# EAGLE design battery-charger (EAGLE 7.3.0)
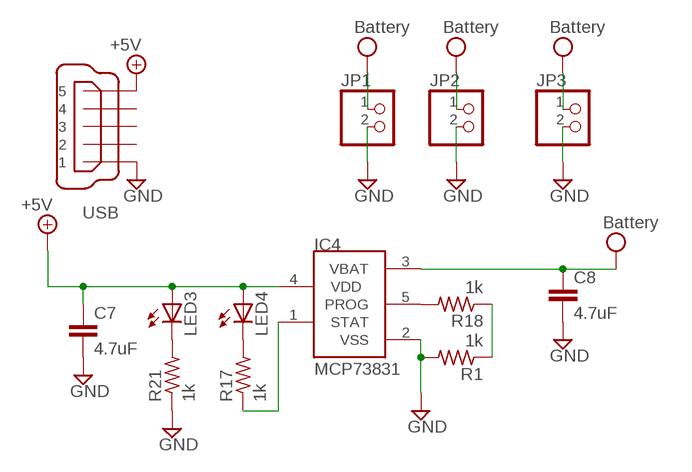
[diagram p0: schematic, sheet 1]

## Parts
C7  4.7uF  C-EU025-024X044  [C025-024X044]
C8  4.7uF  C-EU025-024X044  [C025-024X044]
IC4  MCP73831  [SOT23-5L]
JP1  PINHD-1X2  [1X02]
JP2  PINHD-1X2  [1X02]
JP3  PINHD-1X2  [1X02]
LED3  LED3MM  [LED3MM]
LED4  LED3MM  [LED3MM]
R1  1k  R-US_MELF0204R  [MINI_MELF-0204R]
R17  1k  R-US_MELF0204R  [MINI_MELF-0204R]
R18  1k  R-US_MELF0204R  [MINI_MELF-0204R]
R21  1k  R-US_MELF0204R  [MINI_MELF-0204R]
USB  MICRO-USB-ZX62R-B-5P  [ZX62R-B-5P]

## Nets
+5V/2: C7.1 IC4.4(VDD) LED3.A LED4.A USB.5 ; supply symbol labelled +5V
GND: C7.2 C8.2 IC4.2(VSS) JP1.2 JP2.2 JP3.2 R1.2 R21.1 USB.1
N$1: LED3.K(C) R21.2
N$2: LED4.K(C) R17.2
N$3: R1.1 R18.1
N$20: IC4.1(STAT) R17.1
N$23: IC4.5(PROG) R18.2
VCC: C8.1 IC4.3(VBAT) JP1.1 JP2.1 JP3.1 ; supply symbol labelled Battery
Unconnected: USB.2 USB.3 USB.4

## Library data of the parts
C7 C8 = rcl:C-EU: CAPACITOR, European symbol
IC4 = microchip-update-2:MCP73831: Miniature Single-Cell, Fully Integrated Li-Ion, Li-Polymer Charge Management Controllers
JP1-JP3 = pinhead:PINHD-1X2: PIN HEADER
LED3 LED4 = led:LED: LED OSRAM: - CHIPLED LG R971, LG N971, LY N971, LG Q971, LY Q971, LO R971, LY R971 LH N974, LH R974 LS Q976, LO Q976, LY Q976 LO Q996 - Hyper CHIPLED LW Q18S LB Q993, LB Q99A, LB R99A - SideLED LS A670, LO A670, LY A670, LG A670, LP A670 LB A673, LV A673, LT A673, LW A673 LH A674 LY A675 LS A676, LA A676, LO A676, LY A676, LW A676 LS A679, LY A679, LG A679 - Hyper Micro SIDELED® LS Y876, LA Y876, LO Y876, LY Y876 LT Y87S - SmartLED LW L88C, LW L88S LB L89C, LB L89S, LG L890 LS L89K, LO L89K, LY L89K LS L896, LA L896, LO L896, LY L896 - TOPLED LS T670, LO T670, LY T670, LG T670, LP T670 LSG T670, LSP T670, LSY T670, LOP T670, LYG T670 LG T671, LOG T671, LSG T671 LB T673, LV T673, LT T673, LW T673 LH T674 LS T676, LA T676, LO T676, LY T676, LB T676, LH T676, LSB T676, LW T676 LB T67C, LV T67C, LT T67C, LS T67K, LO T67K, LY T67K, LW E67C LS E67B, LA E67B, LO E67B, LY E67B, LB E67C, LV E67C, LT E67C LW T67C LS T679, LY T679, LG T679 LS T770, LO T770, LY T770, LG T770, LP T770 LB T773, LV T773, LT T773, LW T773 LH T774 LS E675, LA E675, LY E675, LS T675 LS T776, LA T776, LO T776, LY T776, LB T776 LHGB T686 LT T68C, LB T68C - Hyper Mini TOPLED® LB M676 - Mini TOPLED Santana® LG M470 LS M47K, LO M47K, LY M47K Source: http://www.osram.convergy.de LUXEON: - LUMILED® LXK2-PW12-R00, LXK2-PW12-S00, LXK2-PW14-U00, LXK2-PW14-V00 LXK2-PM12-R00, LXK2-PM12-S00, LXK2-PM14-U00 LXK2-PE12-Q00, LXK2-PE12-R00, LXK2-PE12-S00, LXK2-PE14-T00, LXK2-PE14-U00 LXK2-PB12-K00, LXK2-PB12-L00, LXK2-PB12-M00, LXK2-PB14-N00, LXK2-PB14-P00, LXK2-PB14-Q00 LXK2-PR12-L00, LXK2-PR12-M00, LXK2-PR14-Q00, LXK2-PR14-R00 LXK2-PD12-Q00, LXK2-PD12-R00, LXK2-PD12-S00 LXK2-PH12-R00, LXK2-PH12-S00 LXK2-PL12-P00, LXK2-PL12-Q00, LXK2-PL12-R00 Source: www.luxeon.com KINGBRIGHT: KA-3528ASYC Source: www.kingbright.com
R1 R17 R18 R21 = rcl:R-US_: RESISTOR, American symbol
USB = con-hirose:MICRO-USB-: Hirose Micro USB Connector ZX62R-B-5P: Micro B, reverse (top mount) shell SMT Supplier: DigiKey H11574CT-ND Source: http://www.hirose.co.jp/cataloge_hp/e24200011.pdf

## Board
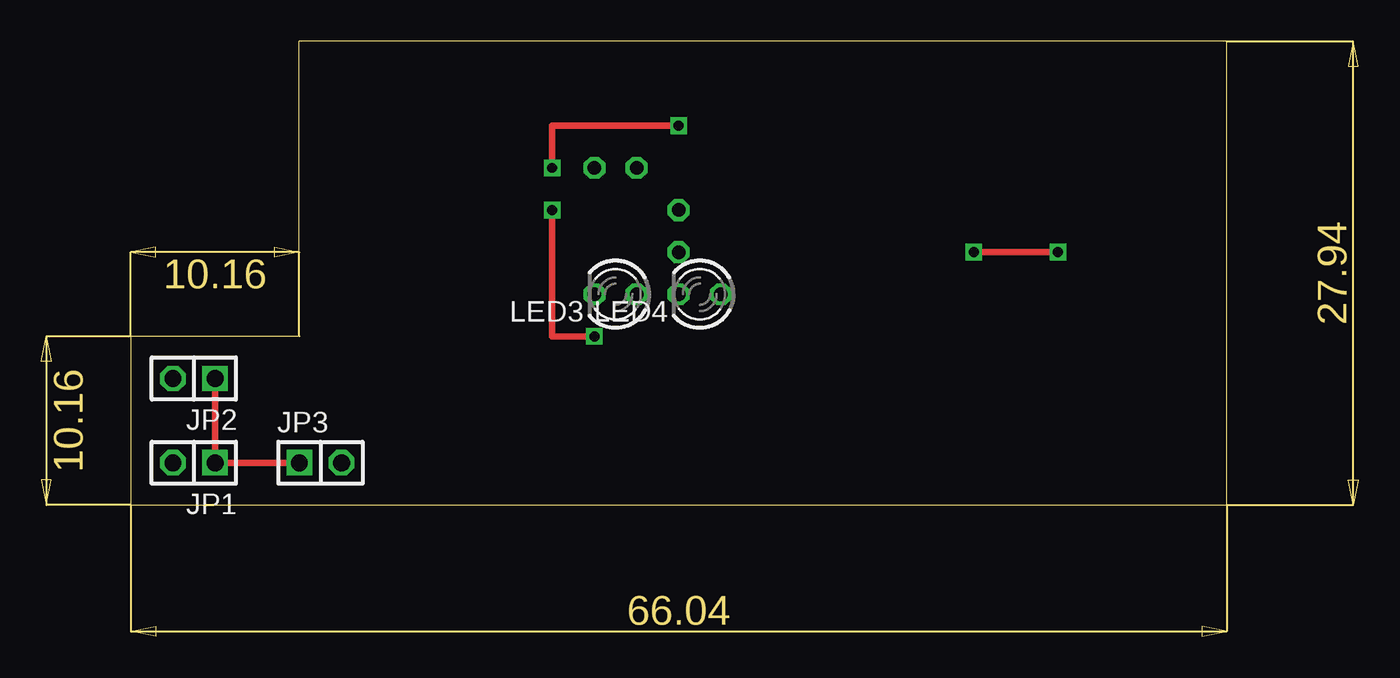
[diagram p1: board, top side]
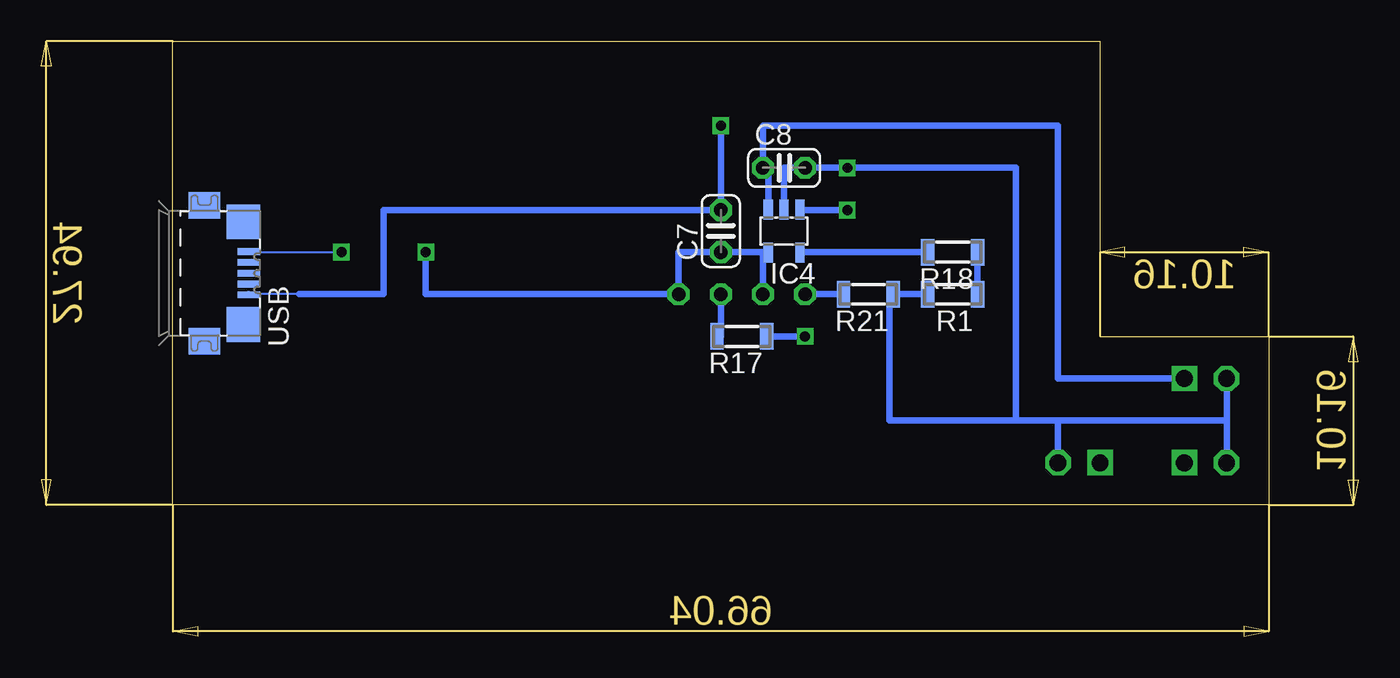
[diagram p2: board, bottom side, seen from below]

Size 66.04 x 27.94 mm. Coordinates in mm from the lower left corner, seen from the top.
Outline: 0,0 66.04,0 66.04,27.94 10.16,27.94 10.16,10.16 0,10.16 0,0
Copper layers (1*16): Top 0.035mm / dielectric 1.5mm / Bottom 0.035mm
Design rules "default": minimum track width 10mil, minimum drill 24mil, track to track 8mil, track to pad 8mil, pad to pad 8mil, via to via 8mil, smd to smd 8mil, copper to edge 40mil, drill to drill 8mil, minimum pad ring 10mil, minimum via ring 8mil, stop-mask expansion 4mil, vias tented up to drill 0mil, thermal gap 10mil

### Footprints (pad centres in the part's own frame; a part is rotated, then mirrored left to right if it is on the bottom)
C025-024X044 = drill 0.813 octagon: 1 -1.27,0; 2 1.27,0
SOT23-5L = smd 0.55 x 1.2: 1 -0.95,-1.3; 2 0,-1.3; 3 0.95,-1.3; 4 0.95,1.3; 5 -0.95,1.3
1X02 = drill 1.016 square: 1 -1.27,0 | drill 1.016 octagon: 2 1.27,0
LED3MM = drill 0.813 octagon: A -1.27,0; K 1.27,0
MINI_MELF-0204R = smd 0.8 x 1.6: 1 -1.5,0; 2 1.5,0
ZX62R-B-5P = smd 1.35 x 0.4: 1 2.675,-1.3; 2 2.675,-0.65; 3 2.675,0; 4 2.675,0.65; 5 2.675,1.3 | smd 1.9 x 1.6: M1 0,-4.1; M2 0,4.1 | smd 2 x 2.1: M3 2.35,3.1; M4 2.35,-3.1

### Placement (x,y rotation side)
C7  33.02,16.51 90 bottom
C8  29.21,20.32 0 bottom
IC4  29.21,16.51 180 bottom
JP1  3.81,2.54 180 top
JP2  3.81,7.62 180 top
JP3  11.43,2.54 0 top
LED3  29.21,12.7 180 top
LED4  34.29,12.7 180 top
R1  19.05,12.7 180 bottom
R17  31.75,10.16 180 bottom
R18  19.05,15.24 180 bottom
R21  24.13,12.7 180 bottom
USB  64.14,13.97 0 bottom

### Tracks (layer width: path | path; a pad name or v marks a point on that pad's centre or on a via)
+5V/2  (via drill 0.6)
  Top 0.406: v50.8,15.24 v55.88,15.24
  Bottom 0.127: 60.96,15.24 v55.88,15.24
  Bottom 0.406: IC4.4 30.48,15.24 | 30.48,15.24 LED3.A | 30.48,15.24 C7.1 35.56,15.24 LED4.A 50.8,12.7 v50.8,15.24 | USB.5 60.96,15.27 60.96,15.24
GND  (via drill 0.6)
  Top 0.406: v25.4,20.32 25.4,22.86 v33.02,22.86
  Bottom 0.127: 58.42,12.7 61.46,12.7
  Bottom 0.406: JP2.2 2.54,5.08 | 2.54,5.08 JP1.2 | 2.54,5.08 12.7,5.08 | 12.7,5.08 15.24,5.08 | 15.24,5.08 22.86,5.08 22.86,12.7 R21.1 20.32,12.7 20.55,12.93 R1.2 | JP3.2 12.7,5.08 | IC4.2 29.21,20.32 C8.2 v25.4,20.32 15.24,20.32 15.24,5.08 | v33.02,22.86 C7.2 53.34,17.78 53.34,12.7 58.42,12.7 | 61.46,12.7 USB.1
N$1
  Bottom 0.406: R21.2 LED3.K
N$2
  Bottom 0.406: R17.2 33.02,10.16 LED4.K
N$3
  Bottom 0.406: R18.1 R1.1
N$20  (via drill 0.6)
  Top 0.406: v27.94,10.16 25.4,10.16 v25.4,17.78
  Bottom 0.406: R17.1 v27.94,10.16 | IC4.1 27.94,17.78 v25.4,17.78
N$23
  Bottom 0.406: 20.32,15.24 R18.2 27.94,15.24 IC4.5
VCC
  Top 0.406: JP2.1 JP1.1 JP3.1
  Bottom 0.406: IC4.3 30.16,20.32 C8.1 30.48,22.86 12.7,22.86 12.7,7.62 JP2.1